# Altium schematic sheet [1]-Controller_Page.SchDoc: STM Bluepill
size A4; DrawnBy: Aviral Mishra; DocumentNumber: 1; Revision: V1.0; SheetNumber: 1; SheetTotal: 2; Company Name: Esteem PCB
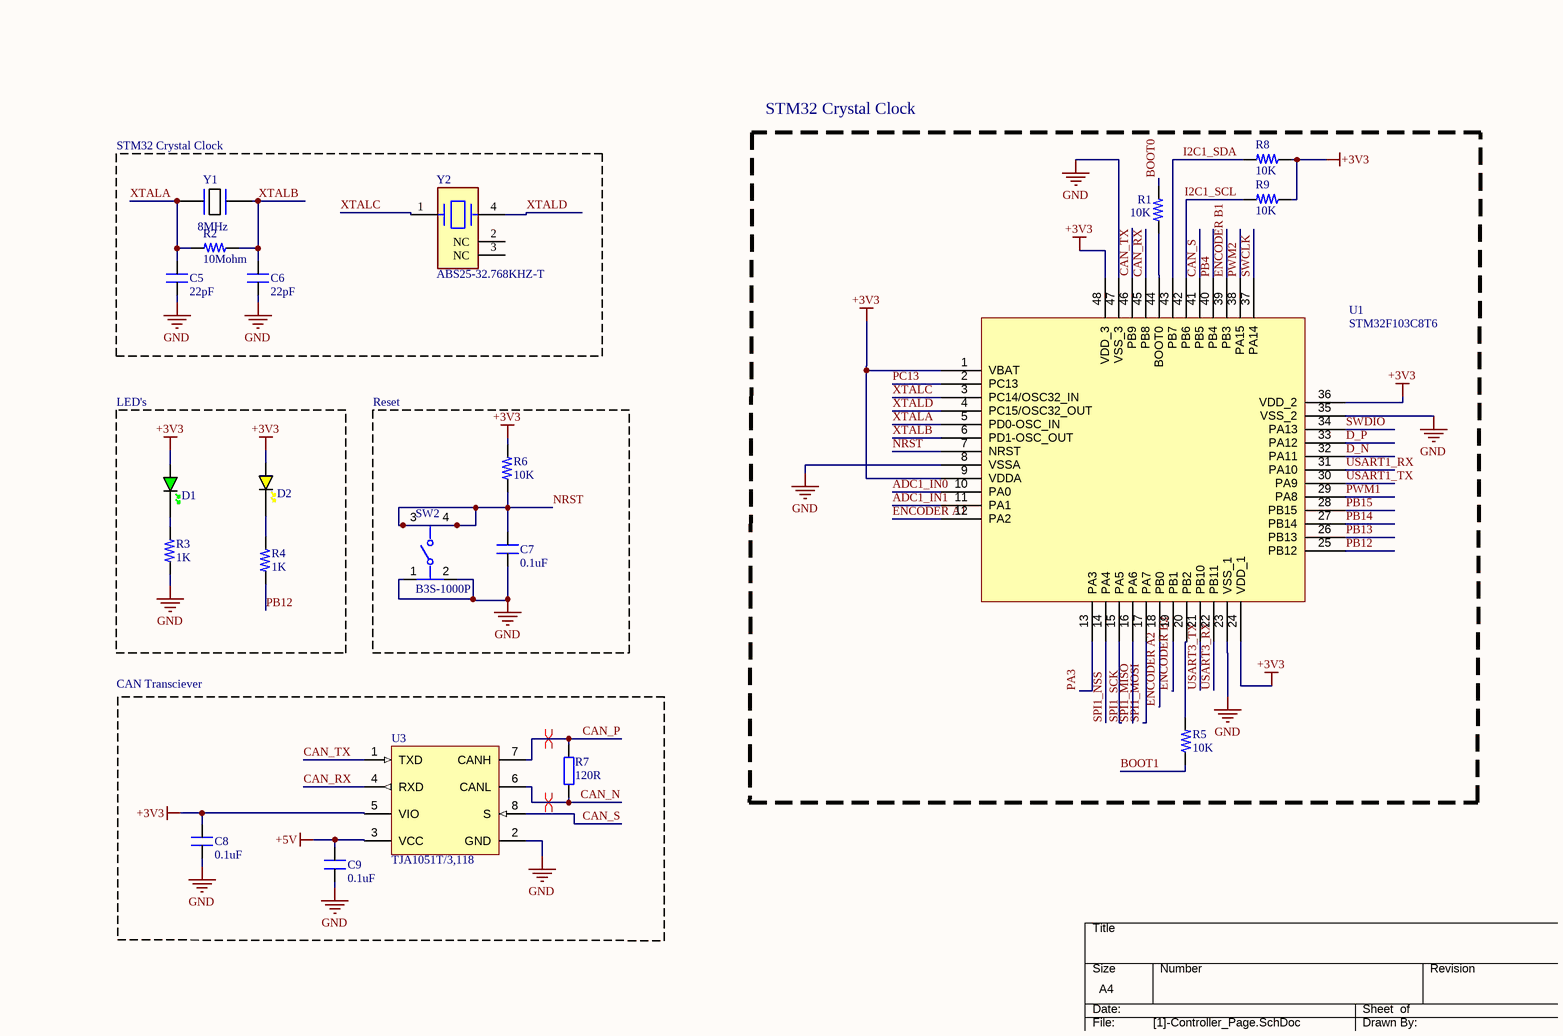
[diagram p0: [1]-Controller_Page.SchDoc]

## Parts
C5  22pF  [CAP_0805]
C6  22pF  [CAP_0805]
C7  0.1uF  [CAP_0805]
C8  0.1uF  [CAP_0805]
C9  0.1uF  [CAP_0805]
D1  GREEN  [LED_0402_GREEN]  (value not drawn)
D2  YELLOW  [LED_0402_YELLOW]  (value not drawn)
R1  10K  [RES_0805]
R2  10Mohm  [RES_0805]
R3  1K  [RES_0805]
R4  1K  [RES_0805]
R5  10K  [RES_0805]
R6  10K  [RES_0805]
R7  120R  [RES_0805]
R8  10K  [RES_0805]
R9  10K  [RES_0805]
SW2  B3S-1000P  [FP-B3S-1000P-MFG]
U1  STM32F103C8T6  [LQFP-48_19.6_393_58X11_SMD]
U3  TJA1051T/3,118  [NXP-SOIC-8_L]
Y1  8MHz  [XTAL_314_240X47_SMD]
Y2  ABS25-32.768KHZ-T  [FP-ABS25-MFG]

## Blocks framed on the sheet
STM32 Crystal Clock: R1 R5 R8 R9 U1
STM32 Crystal Clock: C5 C6 R2 Y1 Y2
LED's: D1 D2 R3 R4
Reset: C7 R6 SW2
CAN Transciever: C8 C9 R7 U3

## Nets
+3V3: C8.2 D1.A D2.A R6.2 R8.2 R9.2 U1.1(VBAT) U1.9(VDDA) U1.24(VDD_1) U1.36(VDD_2) U1.48(VDD_3) U3.5(VIO)
+5V: C9.2 U3.3(VCC)
GND: C5.1 C6.1 C7.1 C8.1 C9.1 R3.1 SW2.1 SW2.2 U1.8(VSSA) U1.23(VSS_1) U1.35(VSS_2) U1.47(VSS_3) U3.2(GND)
ADC1_IN0: U1.10(PA0)
ADC1_IN1: U1.11(PA1)
BOOT0: R1.2
BOOT1: R5.2
CAN_N: R7.1 U3.6(CANL)
CAN_P: R7.2 U3.7(CANH)
CAN_RX: U1.45(PB8) U3.4(RXD)
CAN_S: U1.41(PB5) U3.8(S)
CAN_TX: U1.46(PB9) U3.1(TXD)
D_N: U1.32(PA11)
D_P: U1.33(PA12)
ENCODER A1: U1.12(PA2)
ENCODER A2: U1.18(PB0)
ENCODER B1: U1.39(PB3)
ENCODER B2: U1.19(PB1)
I2C1_SCL: R9.1 U1.42(PB6)
I2C1_SDA: R8.1 U1.43(PB7)
NRST: C7.2 R6.1 SW2.3 SW2.4 U1.7(NRST)
PA3: U1.13(PA3)
PB4: U1.40(PB4)
PB12: R4.1 U1.25(PB12)
PB13: U1.26(PB13)
PB14: U1.27(PB14)
PB15: U1.28(PB15)
PC13: U1.2(PC13)
PWM1: U1.29(PA8)
PWM2: U1.38(PA15)
SPI1_MISO: U1.16(PA6)
SPI1_MOSI: U1.17(PA7)
SPI1_NSS: U1.14(PA4)
SPI1_SCK: U1.15(PA5)
SWCLK: U1.37(PA14)
SWDIO: U1.34(PA13)
USART1_RX: U1.31(PA10)
USART1_TX: U1.30(PA9)
USART3_RX: U1.22(PB11)
USART3_TX: U1.21(PB10)
XTALA: C5.2 R2.1 U1.5(PD0-OSC_IN) Y1.1
XTALB: C6.2 R2.2 U1.6(PD1-OSC_OUT) Y1.2
XTALC: U1.3(PC14/OSC32_IN) Y2.1
XTALD: U1.4(PC15/OSC32_OUT) Y2.4
NetD1_K: D1.K R3.2
NetD2_K: D2.K R4.2
NetR1_1: R1.1 U1.44(BOOT0)
NetR5_1: R5.1 U1.20(PB2)

Not connected (* = marked no-connect by the designer): Y2 2(NC) 3(NC)

## Layout directives
differential pair; differential pair class *: CAN_P
differential pair; net class *: CAN_N

## Notes on the sheet
- DWG. NO.
- REV.
- SHT.
- THIS DOCUMENT AND THE DATA DISCLOSED HEREIN OR HEREWITH IS THE PROPERTY OF ALTIUM LIMITED AND MAY BE FREELY DISTRIBUTED IN WHOLE. NO RIGHTS ARE RESERVED OR EXPRESS OR IMPLIED WARANTEE GIVEN.
- REVISION
- DESCRIPTION
- DATE
- APPROVED
- ENG:
- APPROVALS
- PROJECT
- DSN:
- CHK:
- REFERENCE DOCUMENTS
- PROJECT REVISION:
- TITLE
- DOCUMENT REVISION:
- DESIGN ITEM:
- BOM:
- FAB DWG:
- PCB DWG:
- ASSY DWG:
- SCALE:
- SIZE
- B
- CAGE CODE
- FILE NAME
- DWG NO.
- SHEET
- OF
- REV

## Library data of the parts
C5 C6 = CAP_22pF-50V-5%-0805: 22pF ±5% 50V Ceramic Capacitor C0G, NP0 0805 (2012 Metric); Manufacturer: KEMET; Manufacturer Part Number: C0805C220J5GACTU; Case/Package: 0805; Supplier-1: Digikey; Supplier Part Number-1: 399-1113-1-ND
C7-C9 = CAP_0.1uF-50V-5%-0805: 0.1µF ±5% 50V Ceramic Capacitor X7R 0805 (2012 Metric); Manufacturer: KEMET; Manufacturing Part Number: C0805C104J5RACTU; Case/Package: 0805 (2012 Metric); Supplier-1: Digikey; Supplier Part Number-1: 399-1171-1-ND
D1 = LED_0402_GREEN: LED 0402 GREEN SMD
D2 = LED_0402_YELLOW: LED 0402 YELLOW SMD
R1 R5 R6 R8 R9 = RES_10K-0.125W-1%-0805: 10 kOhms ±1% 0.125W, 1/8W Chip Resistor 0805 (2012 Metric) Moisture Resistant Thick Film; Manufacturer: Yageo; Manufacturing Part Number: RC0805FR-0710KL; Case/Package: 0805; Supplier-1: Digikey; Supplier Part Number-1: 311-10.0KCRCT-ND
R2 = RES_10MOHM-0.125W-1%-0805: 10 MOhms ±1% 0.125W, 1/8W Chip Resistor 0805 (2012 Metric) Automotive AEC-Q200, High Voltage Thick Film; Manufacturer: Rohm Semiconductor; Manufacturing Part Number: KTR10EZPF1005; Case/Package: 0805 (2012 Metric); Supplier-1: Digikey; Supplier Part Number-1: RHM10.0MAHCT-ND
R3 R4 = RES_1K-0.125W-1%-0805: 1 kOhms ±1% 0.125W, 1/8W Chip Resistor 0805 (2012 Metric) Moisture Resistant Thick Film; Manufacturer: 垈㎵á; Manufacturer Part Number: RC0805FR-071KL; Case/Package: 0805; Supplier-1: Digikey; Supplier Part Number-1: 311-1.00KCRCT-ND
R7 = RES_0805: Resistor SMD 0805; Manufacturer: *; Manufacturer Part Number: *; Distributor Link: *; LCSC: *
SW2 = CMP-08834-000008-1: SWITCH TACTILE SPST-NO 0.05A 24V; Throw Configuration: SPST; Switch Function: Off-Mom; Switch Travel: 0.25mm; Contact Current Rating: 50mA; Actuator Length: 0.8mm; Mechanical Life: 500000Cycles; Contact Resistance: 100mR; Operating Force: 1.57N; Actuator Type: Standard; Illumination Type: Non-Illuminated; Ratings: IP67; Number of Poles: 1; Package Quantity: 1; Orientation: Straight; REACH SVHC: No SVHC; Lead Free: Lead Free; Max Current Rating: 50mA; Contact Plating: Silver; Current Rating: 50mA; Depth: 9mm; Contact Material: Bronze; Electrical Life: 500000Cycles; Termination: Gull Wing; Width: 6mm; Packaging: Tape and Reel; Min Operating Temperature: -25°C; Radiation Hardening: No; Max Voltage Rating (DC): 24V; Max Operating Temperature: 70°C; Length: 6.6mm; Height: 3.65mm; Voltage Rating (DC): 24V; Weight: 0.010582oz; Mount: Surface Mount
U1 = IC-STM32F103C8T6 _1: ARM® Cortex®-M3 STM32F1 Microcontroller IC 32-Bit 72MHz 64KB (64K x 8) FLASH; Manufacturer: STMicroelectronics; Manufacturer Part Number: STM32F103C8T6; Case/Package: 48-LQFP; Supplier-1: Digikey; Supplier Part Number-1: 497-6063-ND
U3 = CMP-2000-07245-1: High-Speed CAN Transceiver, 3 to 5 V, 8-Pin SOIC (SOT96-1), RoHS, Tape and Reel; Manufacturer: NXP; Power Down Mode: Normal/Silent; Rad Hardened: No; Number of Transceivers: 1; Supply Current: 70mA; Operating Supply Voltage (Max): 5.5V; Operating Supply Voltage (Typ): 5V; Operating Supply Voltage (Min): 4.5V; Standard Supported: ISO11898-2; Data Rate: 1Mbps; DELETED: Compliant; Operating Temperature (Min): -40C; Datasheet Version: Rev. 7, 01/2015; Pin Count: 8; Operating Temperature (Max): 125C; Package Description: 8-Pin Small Outline Integrated Circuit, Body 4.9 x 3.9 mm, Pitch 1.27 mm; Category: Transceiver; Packaging: TapeandReel; Mounting: SurfaceMount; Package Reference: SOT96-1; Operating Temperature Classification: Automotive; Mounting Technology: SurfaceMount; Package Type: SO; Manufacturer URL: http://www.nxp.com/; Datasheet URL: http://www.nxp.com/documents/data_sheet/TJA1051.pdf
Y1 = XTAL_8MHZ-LFXTAL030234: Crystals 8MHz 22pF -20C 70C; Manufacturer: IQD Frequency Products; Manufacturing Part Number: LFXTAL030234Reel; Case/Package: SMD; Supplier-1: Mouser; Supplier Part Number-1: 449-LFXTAL030234REEL
Y2 = CMP-2000-05037-2: CRYSTAL 32.7680KHZ 12.5PF SMD; ESR (Equivalent Series Resistance): 50kR; Tolerance: 20ppm; Width: 3.8mm; REACH SVHC: No SVHC; Load Capacitance: 12.5pF; Case/Package: SMD/SMT; Radiation Hardening: No; Series: ABS25; Number of Pins: 4; Mount: Surface Mount; RoHS Compliant: Yes; Packaging: Tape and Reel; Termination: SMD/SMT; Frequency Tolerance: 20ppm; Lead Free: Lead Free; Package Quantity: 1000; Min Operating Temperature: -40°C; Height: 0.098inch; Length: 8mm; Frequency: 32.768kHz; Max Operating Temperature: 85°C; Series Resistance: 50kR; Operating Frequency: 32.768 kHz; Depth: 3.8mm